# Altium schematic sheet PWMswitch.SchDoc
size A4
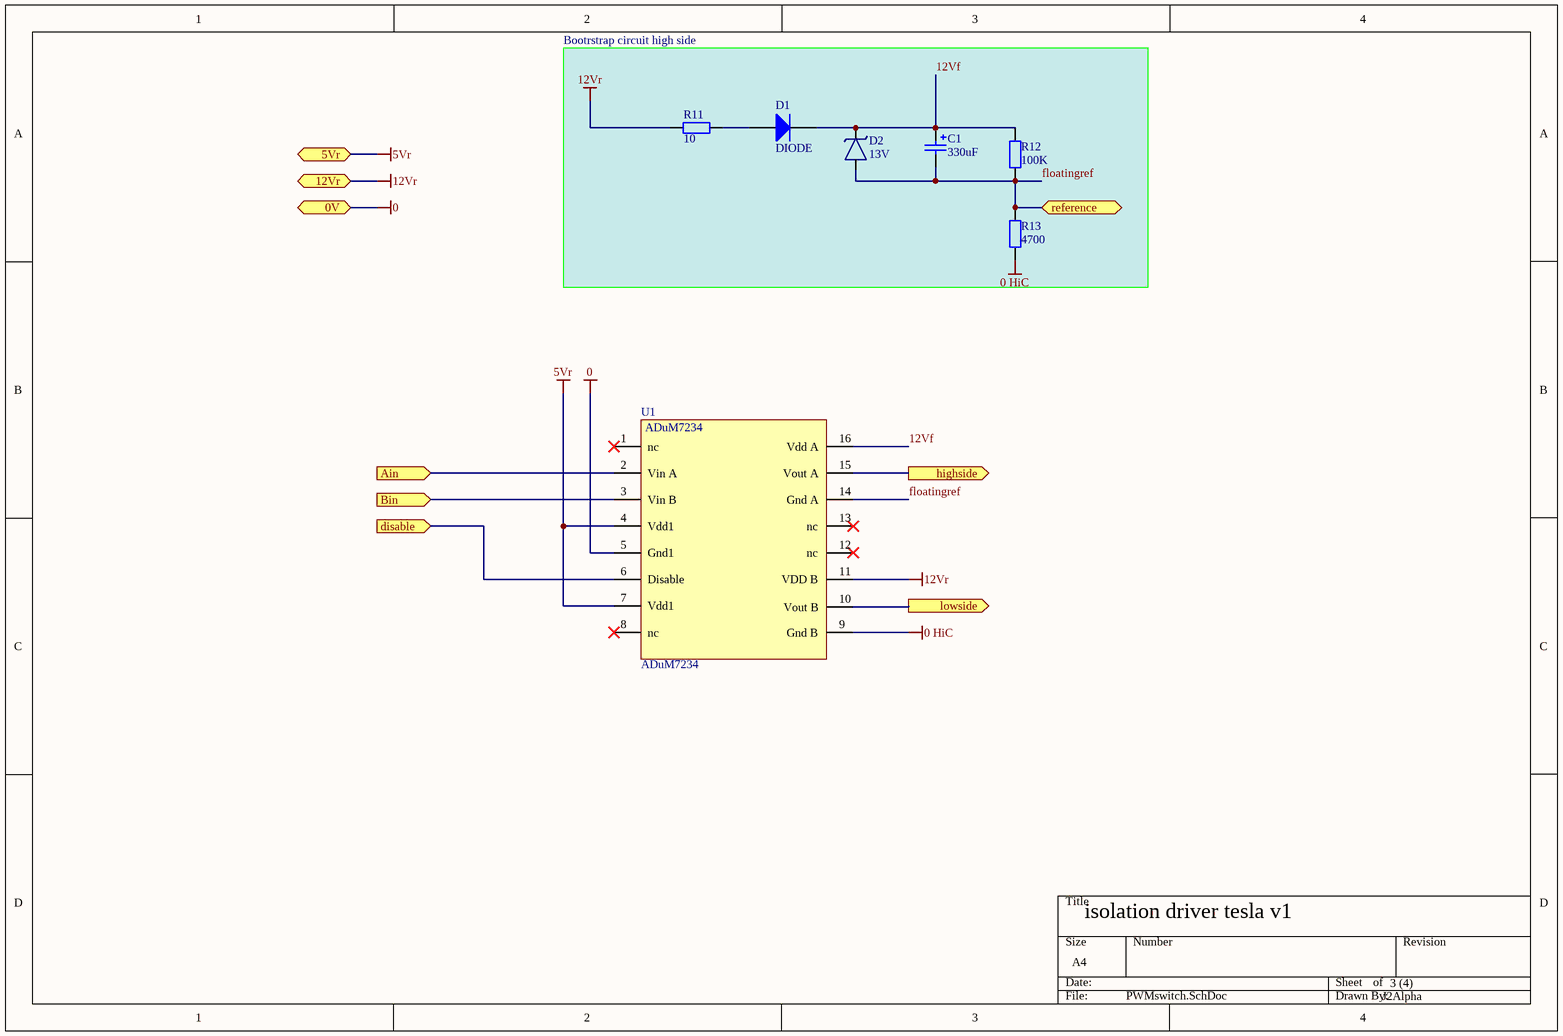
[diagram p0: PWMswitch.SchDoc]

## Parts
C1  330uF  [1608[0603]]
D1  DIODE  [SMB]
D2  13V  [SOT95P240-3N]
R11  10  [1005[0402]]
R12  100K  [1005[0402]]
R13  4700  [1005[0402]]
U1  ADuM7234  [SOIC127P600-16N]

## Blocks framed on the sheet
Bootrstrap circuit high side: C1 D1 D2 R11-R13

## Ports
0V, 5Vr, 12Vr, Ain (in), Bin (in), disable (in), highside (out), lowside (out), reference

## Nets
0: U1.5(Gnd1) ; port 0V
0 HiC: R13.1 U1.9(Gnd_B)
5Vr: U1.4(Vdd1) U1.7(Vdd1) ; port 5Vr
12Vr: R11.1 U1.11(VDD_B) ; port 12Vr
12Vf: C1.1 D1.K D2.3 R12.2 U1.16(Vdd_A)
Ain: U1.2(Vin_A) ; port Ain
Bin: U1.3(Vin_B) ; port Bin
disable: U1.6(Disable) ; port disable
floatingref: C1.2 D2.1 R12.1 R13.2 U1.14(Gnd_A) ; port reference
highside: U1.15(Vout_A) ; port highside
lowside: U1.10(Vout_B) ; port lowside
NetD1_A: D1.A R11.2

Not connected (* = marked no-connect by the designer): D2 2; U1 1(nc)* 8(nc)* 12(nc)* 13(nc)*

## Notes on the sheet
- isolation driver tesla v1
- 3 (4)
- J2Alpha

## Library data of the parts
C1 = Cap_pol_mm: Capacitor polorized; Published: 8-Jun-2000; LatestRevisionDate: 17-Jul-2002; LatestRevisionNote: Re-released for DXP Platform.; PackageReference: RAD-0.3; Publisher: Altium Limited; Farnell code: *; Value: 330uF
D1 = DIODE: regular diode; farnell code: 1467550
D2 = zennerdiode sot23: Zener; Value: 13V
R11-R13 = Res_mm: Resistor; Published: 8-Jun-2000; LatestRevisionDate: 17-Jul-2002; LatestRevisionNote: Re-released for DXP Platform.; PackageReference: AXIAL-0.4; Publisher: Altium Limited; Farnell code: *
  R11: Value: 10; Mouser: 667-ERJ-XGNJ100Y
  R12: Value: 100K; Mouser: 660-RK73B1FTTBL104J
  R13: Value: 4700; Mouser: 667-ERJ-XGNJ472Y
U1 = ADuM7234: ADuM7234 dual isolated gate driver; Mouser: 584-ADUM7234BRZ